# EAGLE schematic power_layout (EAGLE 9.6.2)

## Sheet 1 of 2
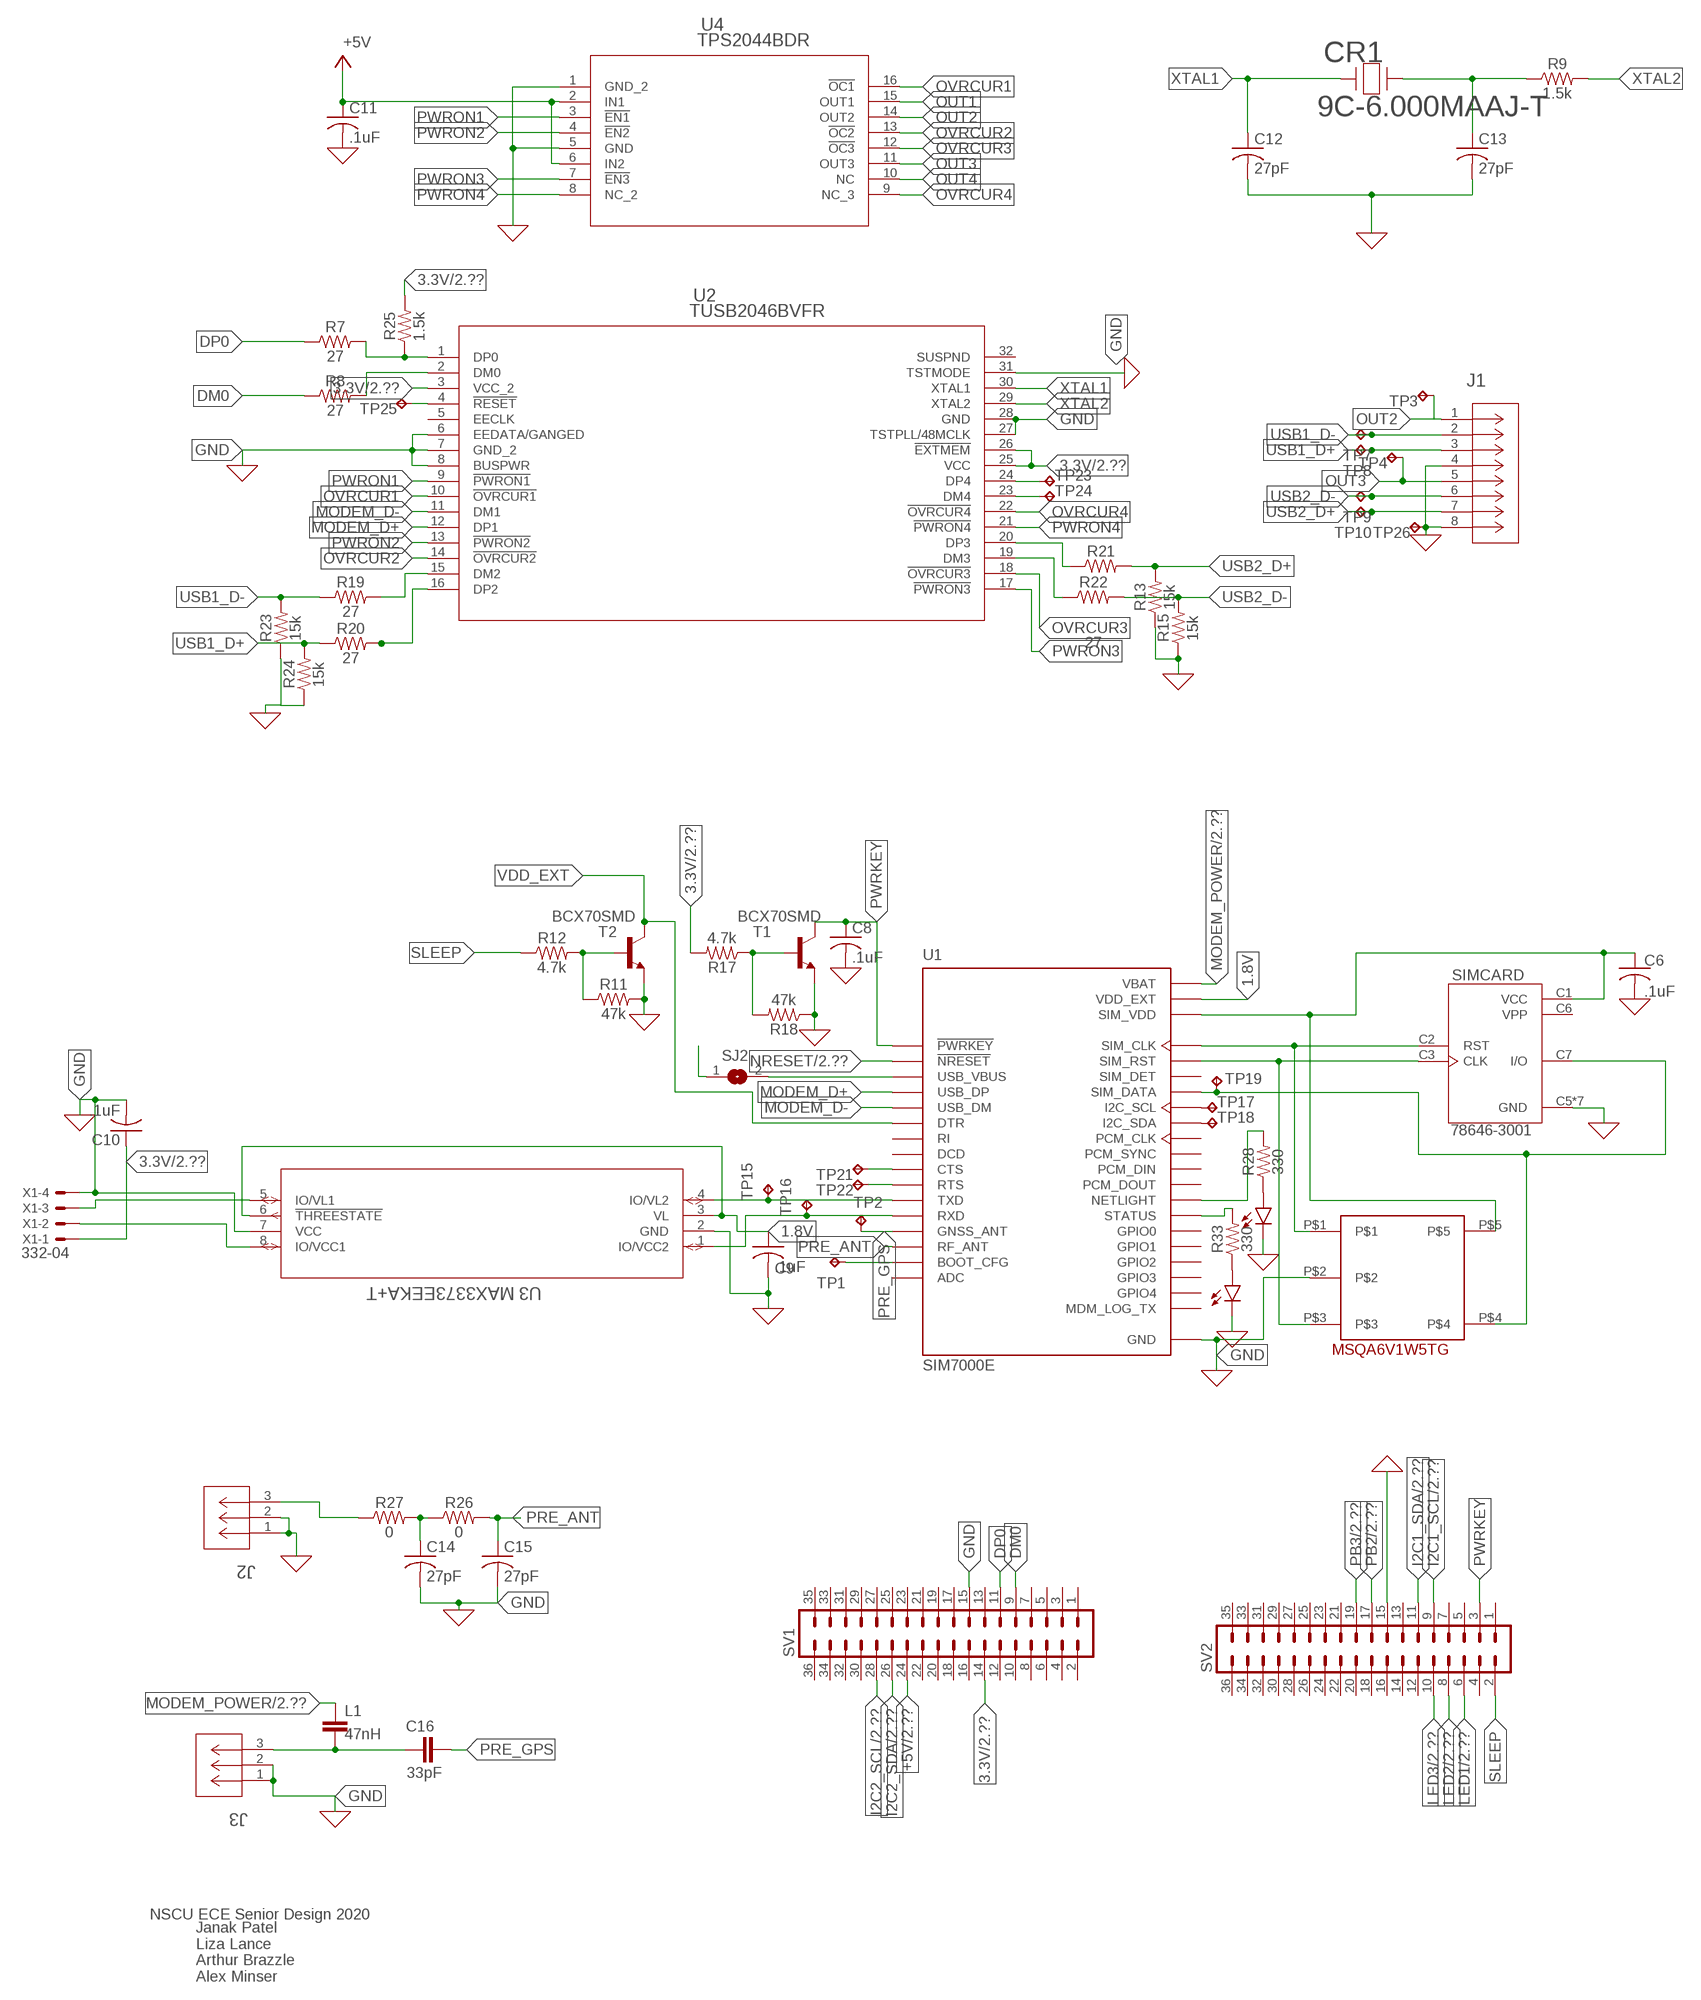
[diagram p0: schematic, sheet 1]

### Parts
C6  .1uF  C-USC0805  [C0805]
C8  .1uF  C-USC0805  [C0805]
C9  .1uF  C-USC0805  [C0805]
C10  .1uF  C-USC0805  [C0805]
C11  .1uF  C-USC0805  [C0805]
C12  27pF  C-USC0603  [C0603]
C13  27pF  C-USC0603  [C0603]
C14  27pF  C-USC0603  [C0603]
C15  27pF  C-USC0603  [C0603]
C16  33pF  C-EUC0603K  [C0603K]
CR1  9C-6.000MAAJ-T  [CRYSTAL_TXC_9C_TXC]
D4  Yellow  LED-YELLOW0603  [LED-0603]
D5  Yellow  LED-YELLOW0603  [LED-0603]
J1  AU-Y1008-2  [CONN_AU-Y1008-2_ASM]
J2  U.FL-R-SMT-1(01)  [CONN_-SMT-1(01)]
J3  U.FL-R-SMT-1(01)  [CONN_-SMT-1(01)]
L1  47nH  C-EUC1608  [C1608]
R7  27  RESISTOR0805  [0805]
R8  27  RESISTOR0805  [0805]
R9  1.5k  1KOHM-0603-1/10W-1%  [0603]
R11  47k  47KOHM-0603-1/10W-1%  [0603]
R12  4.7k  4.7KOHM-0603-1/10W-1%  [0603]
R13  15k  RESISTOR0805  [0805]
R15  15k  RESISTOR0805  [0805]
R17  4.7k  4.7KOHM-0603-1/10W-1%  [0603]
R18  47k  47KOHM-0603-1/10W-1%  [0603]
R19  27  RESISTOR0805  [0805]
R20  27  RESISTOR0805  [0805]
R21  27  RESISTOR0805  [0805]
R22  27  RESISTOR0805  [0805]
R23  15k  RESISTOR0805  [0805]
R24  15k  RESISTOR0805  [0805]
R25  1.5k  RESISTOR0805  [0805]
R26  0  1KOHM-0603-1/10W-1%  [0603]
R27  0  1KOHM-0603-1/10W-1%  [0603]
R28  330  1KOHM-0603-1/10W-1%  [0603]
R33  330  1KOHM-0603-1/10W-1%  [0603]
SIMCARD  78646-3001  [MOLEX_78646-3001]
SJ2  SJ  [SJ]
SV1  MA18-2  [MA18-2]
SV2  MA18-2  [MA18-2]
T1  BCX70SMD  [SOT23]
T2  BCX70SMD  [SOT23]
TP1  TPTP10R  [TP10R]
TP2  TPTP16R  [TP16R]
TP3  TPTP10R  [TP10R]
TP4  TPTP10R  [TP10R]
TP7  TPTP10R  [TP10R]
TP8  TPTP10R  [TP10R]
TP9  TPTP10R  [TP10R]
TP10  TPTP10R  [TP10R]
TP15  TPTP10R  [TP10R]
TP16  TPTP10R  [TP10R]
TP17  TPTP10R  [TP10R]
TP18  TPTP10R  [TP10R]
TP19  TPTP10R  [TP10R]
TP21  TPTP10R  [TP10R]
TP22  TPTP10R  [TP10R]
TP23  TPTP10R  [TP10R]
TP24  TPTP10R  [TP10R]
TP25  TPTP10R  [TP10R]
TP26  TPTP10R  [TP10R]
U1  SIM7000E  [SIMCON_SIM7000E]
U2  TUSB2046BVFR  [VF32_TEX]
U3  MAX3373EEKA+T  [21-0078H]
U4  TPS2044BDR  [D16_TEX]
U5  MSQA6V1W5T2G  [SOT-23-5_M5]
X1  332-04  [332-04]

### Nets
1.8V: C9.1 U1.15(VDD_EXT) U3.3(VL) U3.6(!THREESTATE)
3.3V [POWER]: C10.1 R17.2 R25.2 SV1.14 U2.3(VCC_2) U2.25(VCC) U2.26(!EXTMEM) X1.1 ; also sheet 2
+5V [POWER]: C11.1 SJ2.1 SV1.24 U4.2(IN1) U4.6(IN2) ; also sheet 2
DM0: R8.1 SV1.9
DP0: R7.1 SV1.11
GND [POWER]: C6.2 C8.2 C9.2 C10.2 C11.2 C12.2 C13.2 C14.2 C15.2 D4.C D5.C J1.4 J1.8 J2.1 J2.2 J3.1 J3.2 R11.2 R13.1 R15.1 R18.1 R23.1 R24.1 SIMCARD.C5(GND) SIMCARD.G1(GND) SIMCARD.G2(GND) SIMCARD.G3(GND) SIMCARD.G4(GND) SIMCARD.G5(GND) SIMCARD.G6(GND) SV1.15 SV2.15 T1.2(E) T2.2(E) TP26.TP U1.2(GND) U1.17(GND) U1.18(GND) U1.29(GND) U1.39(GND) U1.45(GND) U1.46(GND) U1.54(GND) U1.58(GND) U1.59(GND) U1.61(GND) U1.62(GND) U1.63(GND) U1.64(GND) U1.65(GND) U2.6(EEDATA/GANGED) U2.7(GND_2) U2.8(BUSPWR) U2.27(TSTPLL/48MCLK) U2.28(GND) U2.31(TSTMODE) U3.2(GND) U3.7(VCC) U4.1(GND_2) U4.5(GND) U5.P$2 X1.4 ; also sheet 2
I2C1_SCL: SV2.9 ; also sheet 2
I2C1_SDA: SV2.11 ; also sheet 2
I2C2_SCL: SV1.28 ; also sheet 2
I2C2_SDA: SV1.26 ; also sheet 2
LED1: SV2.6 ; also sheet 2
LED2: SV2.8 ; also sheet 2
LED3: SV2.10 ; also sheet 2
MODEM_D+: U1.27(USB_DP) U2.12(DP1)
MODEM_D-: U1.28(USB_DM) U2.11(DM1)
MODEM_POWER: L1.1 U1.55(VBAT) U1.56(VBAT) U1.57(VBAT) ; also sheet 2
N$1: C6.1 SIMCARD.C1(VCC) U1.30(SIM_VDD) U5.P$5
N$2: SIMCARD.C3(CLK) U1.33(SIM_RST) U5.P$3
N$4: SIMCARD.C2(RST) U1.32(SIM_CLK) U5.P$1
N$6: SIMCARD.C7(I/O) TP19.TP U1.31(SIM_DATA) U5.P$4
N$9: TP1.TP U1.6(BOOT_CFG)
N$10: R7.2 R25.1 U2.1(DP0)
N$11: C14.1 R26.1 R27.2
N$12: R8.2 U2.2(DM0)
N$13: U3.8(IO/VCC1) X1.2
N$14: C13.1 CR1.2 R9.1
N$15: C16.1 J3.3 L1.2
N$16: U3.5(IO/VL1) X1.3
N$17: R11.1 R12.2 T2.1(B)
N$18: R17.1 R18.2 T1.1(B)
N$19: R19.2 U2.15(DM2)
N$20: R20.2 U2.16(DP2)
N$21: TP21.TP U1.7(CTS)
N$22: R21.1 U2.20(DP3)
N$23: R22.1 U2.19(DM3)
N$24: TP17.TP U1.38(I2C_SCL)
N$25: TP23.TP U2.24(DP4)
N$26: TP24.TP U2.23(DM4)
N$27: TP16.TP U1.10(RXD) U3.1(IO/VCC2)
N$28: TP15.TP U1.9(TXD) U3.4(IO/VL2)
N$29: R28.2 U1.52(NETLIGHT)
N$30: D4.A R28.1
N$31: TP18.TP U1.37(I2C_SDA)
N$32: TP22.TP U1.8(RTS)
N$33: R33.2 U1.66(STATUS)
N$34: TP25.TP U2.4(!RESET)
N$35: J2.3 R27.1
N$36: SJ2.2 U1.24(USB_VBUS)
N$37: D5.A R33.1
NRESET: U1.16(!NRESET) ; also sheet 2
OUT1: U4.15(OUT1)
OUT2: J1.1 TP3.TP U4.14(OUT2)
OUT3: J1.5 TP4.TP U4.11(OUT3)
OUT4: U4.10(NC)
OVRCUR1: U2.10(!OVRCUR1) U4.16(!OC1)
OVRCUR2: U2.14(!OVRCUR2) U4.13(!OC2)
OVRCUR3: U2.18(!OVRCUR3) U4.12(!OC3)
OVRCUR4: U2.22(!OVRCUR4) U4.9(NC_3)
PB2: SV2.17 ; also sheet 2
PB3: SV2.19 ; also sheet 2
PRE_ANT: C15.1 R26.2 U1.60(RF_ANT)
PRE_GPS: C16.2 TP2.TP U1.53(GNSS_ANT)
PWRKEY: C8.1 SV2.3 T1.3(C) U1.1(!PWRKEY)
PWRON1: U2.9(!PWRON1) U4.3(!EN1)
PWRON2: U2.13(!PWRON2) U4.4(!EN2)
PWRON3: U2.17(!PWRON3) U4.7(!EN3)
PWRON4: U2.21(!PWRON4) U4.8(NC_2)
SLEEP: R12.1 SV2.2
USB1_D+: J1.3 R20.1 R24.2 TP8.TP
USB1_D-: J1.2 R19.1 R23.2 TP7.TP
USB2_D+: J1.7 R13.2 R21.2 TP10.TP
USB2_D-: J1.6 R15.2 R22.2 TP9.TP
VDD_EXT [POWER]: T2.3(C) U1.3(DTR)
XTAL1: C12.1 CR1.1 U2.30(XTAL1)
XTAL2: R9.2 U2.29(XTAL2)
Unconnected: SV1.1 SV1.2 SV1.3 SV1.4 SV1.5 SV1.6 SV1.7 SV1.8 SV1.10 SV1.12 SV1.13 SV1.16 SV1.17 SV1.18 SV1.19 SV1.20 SV1.21 SV1.22 SV1.23 SV1.25 SV1.27 SV1.29 SV1.30 SV1.31 SV1.32 SV1.33 SV1.34 SV1.35 SV1.36 SV2.1 SV2.4 SV2.5 SV2.7 SV2.12 SV2.13 SV2.14 SV2.16 SV2.18 SV2.20 SV2.21 SV2.22 SV2.23 SV2.24 SV2.25 SV2.26 SV2.27 SV2.28 SV2.29 SV2.30 SV2.31 SV2.32 SV2.33 SV2.34 SV2.35 SV2.36 U1.4(RI) U1.5(DCD) U1.11(PCM_CLK) U1.12(PCM_SYNC) U1.13(PCM_DIN) U1.14(PCM_DOUT) U1.23(MDM_LOG_TX) U1.25(ADC) U1.34(SIM_DET) U1.48(GPIO4) U1.49(GPIO1) U1.50(GPIO0) U1.67(GPIO2) U1.68(GPIO3) U2.5(EECLK) U2.32(SUSPND)

### Notes on the sheet
- NSCU ECE Senior Design 2020
- Janak Patel
  Liza Lance
  Arthur Brazzle
  Alex Minser

## Sheet 2 of 2
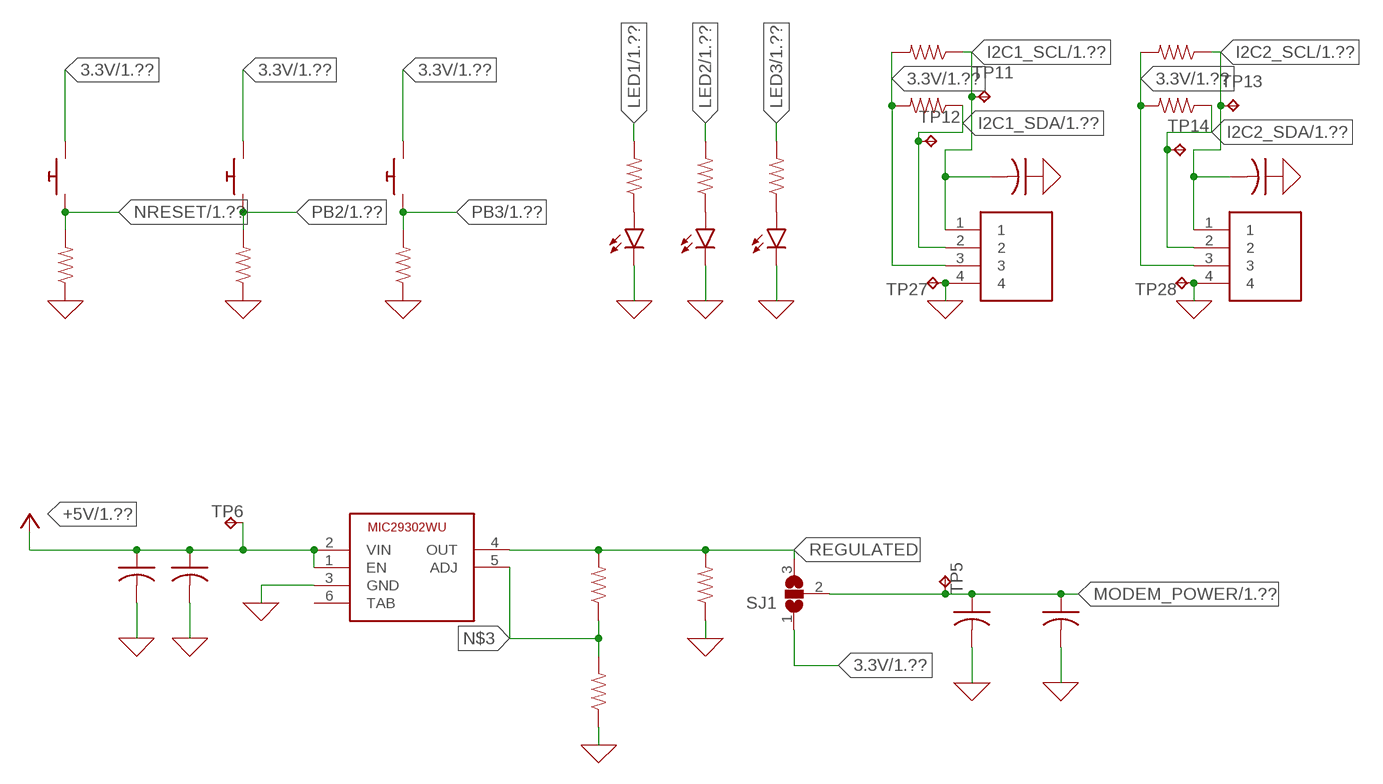
[diagram p1: schematic, sheet 2]

### Parts
C1  100uF  C-USC0805  [C0805]
C2  0.1uF  C-USC0805  [C0805]
C3  330uF  C-USC1210  [C1210]
C4  1uF  C-USC0805  [C0805]
C5  100nF  C-USC0805  [C0805]
C7  0.1uF  C-USC0805  [C0805]
D1  RED  LED-RED1206  [LED-1206]
D2  GREEN  LED-GREEN1206  [LED-1206]
D3  BLUE  LED-BLUE1206  [LED-1206]
GROVE1  640456-4  [TE_640456-4]
GROVE2  640456-4  [TE_640456-4]
POWER_SUPPLY  MIC29302WU  [TO263-5]
R1  60.4  RESISTOR0805  [0805]
R2  180  RESISTOR0805  [0805]
R3  180  RESISTOR0805  [0805]
R4  47k  RESISTOR0805  [0805]
R5  100k  RESISTOR0805  [0805]
R6  470k  RESISTOR0805  [0805]
R10  4700  RESISTOR0805  [0805]
R14  4700  RESISTOR0805  [0805]
R16  4700  RESISTOR0805  [0805]
R29  4700  RESISTOR0805  [0805]
R30  4700  RESISTOR0805  [0805]
R31  4700  RESISTOR0805  [0805]
R32  4700  RESISTOR0805  [0805]
SJ1  SJ2W  [SJ_2]
SW1  SWITCH_PUSHBUTTONSOFTTOUCHSMD_SJ  [PUSHBUTTON_SMD_SJ]
SW2  SWITCH_PUSHBUTTONSOFTTOUCHSMD_SJ  [PUSHBUTTON_SMD_SJ]
SW3  SWITCH_PUSHBUTTONSOFTTOUCHSMD_SJ  [PUSHBUTTON_SMD_SJ]
TP5  TPTP10R  [TP10R]
TP6  TPTP10R  [TP10R]
TP11  TPTP10R  [TP10R]
TP12  TPTP10R  [TP10R]
TP13  TPTP10R  [TP10R]
TP14  TPTP10R  [TP10R]
TP27  TPTP10R  [TP10R]
TP28  TPTP10R  [TP10R]

### Nets
3.3V [POWER]: GROVE1.3 GROVE2.3 R29.2 R30.2 R31.2 R32.2 SJ1.1 SW1.P$2 SW2.P$2 SW3.P$2 ; also sheet 1
+5V [POWER]: C1.1 C4.1 POWER_SUPPLY.1(EN) POWER_SUPPLY.2(VIN) TP6.TP ; also sheet 1
GND [POWER]: C1.2 C2.1 C3.2 C4.2 C5.2 C7.1 D1.C D2.C D3.C GROVE1.4 GROVE2.4 POWER_SUPPLY.3(GND) R4.1 R6.1 R10.1 R14.1 R16.1 TP27.TP TP28.TP ; also sheet 1
I2C1_SCL: C2.2 GROVE1.1 R29.1 TP11.TP ; also sheet 1
I2C1_SDA: GROVE1.2 R30.1 TP12.TP ; also sheet 1
I2C2_SCL: C7.2 GROVE2.1 R31.1 TP13.TP ; also sheet 1
I2C2_SDA: GROVE2.2 R32.1 TP14.TP ; also sheet 1
LED1: R3.2 ; also sheet 1
LED2: R2.2 ; also sheet 1
LED3: R1.2 ; also sheet 1
MODEM_POWER: C3.1 C5.1 SJ1.2 TP5.TP ; also sheet 1
N$3: POWER_SUPPLY.5(ADJ) R4.2 R5.1
N$5: D3.A R1.1
N$7: D2.A R2.1
N$8: D1.A R3.1
NRESET: R10.2 SW1.P$1 ; also sheet 1
PB2: R14.2 SW2.P$1 ; also sheet 1
PB3: R16.2 SW3.P$1 ; also sheet 1
REGULATED: POWER_SUPPLY.4(OUT) R5.2 R6.2 SJ1.3
Unconnected: POWER_SUPPLY.6(TAB)

## Power pins joined to a net without a drawn wire
VPP: SIMCARD.C6(VPP)

## Library data of the parts
C1-C15 = rcl:C-US: CAPACITOR, American symbol; SPICEPREFIX: C
C16 L1 = rcl:C-EU: CAPACITOR, European symbol; SPICEPREFIX: C
CR1 = Personal:9C-6.000MAAJ-T; BUILT_BY: EMA_UL_Team; MANUFACTURER_PART_NUMBER: 9C-6.000MAAJ-T; SOURCELIBRARY: TXC_2011-01-01_CRYSTAL_9C; VENDOR: TXC
D1 = SparkFun-LED:LED-RED: Red SMD LED Used in manufacturing of most products at SparkFun Packages: 0603 - SMD 0603 package [Product Link] <http://docs.avagotech.com/docs/AV02-0551EN> 0603 SMART - SMD 0603 SMART package ( more efficient and expensive)[Product Link] <http://www.osram-os.com/Graphics/XPic2/00077099_0.pdf> 1206 - SMD1206 package [Product Link] <https://www.sparkfun.com/datasheets/DevTools/LilyPad/Q150OVS4.pdff> SparkFun Products: Pro Mini 328 -5V <https://www.sparkfun.com/products/821> RedBoard <https://www.sparkfun.com/products/12757> IOIO-OTG <https://www.sparkfun.com/products/13613>; PROD_ID: DIO-09912
D2 = SparkFun-LED:LED-GREEN: Green SMD LED Used in manufacturing of various products at SparkFun Packages: 0603 - SMD 0603 package [Product Link] <http://www.futureelectronics.com/en/technologies/semiconductors/optoelectronics/leds/Pages/9894312-LTST-C190GKT.aspx?CrossPart=HSMG-C190&IM=0> LilyPad 1206 - SMD1206 LilyPad package [Product Link] <http://www.futureelectronics.com/en/Technologies/Product.aspx?ProductID=IN150NGHARVATEKCORPORATION2049943&IM=0> 1206 - SMD1206 package [Product Link] <http://www.futureelectronics.com/en/technologies/semiconductors/optoelectronics/leds/Pages/8315665-LTST-C150KGKT.aspx?IM=0> 1206 Bottom Mount -SMD 1206 Bottom Mount [Product Link] <http://www.digikey.com/product-detail/en/lite-on-inc/LTST-C230KGKT/160-1456-1-ND/386854> SparkFun Products: Pro Mini 328 -5V <https://www.sparkfun.com/products/821> RedBoard <https://www.sparkfun.com/products/12757> MP3 Trigger <https://www.sparkfun.com/products/13720> Makey Makey <https://www.sparkfun.com/products/11076>; PROD_ID: DIO-00862
D3 = SparkFun-LED:LED-BLUE: Blue SMD LED Used in manufacturing of various products at SparkFun Packages: 0603 - SMD 0603 package [Product Link] <http://www.digikey.com/product-detail/en/SMLE12BC7TT86/511-1589-2-ND/1641808> 1206 - SMD1206 package [Product Link] <http://www.digikey.com/product-detail/en/lite-on-inc/LTST-C150TBKT/160-1643-1-ND/573584> SparkFun Products: ESP8266 Thing-Dev Board <https://www.sparkfun.com/products/13711> RedBoard <https://www.sparkfun.com/products/12757>; PROD_ID: DIO-09911
D4 D5 = SparkFun-LED:LED-YELLOW: Yellow SMD LED Used in manufacturing several products at SparkFun. Packages: 0603 - SMD 0603 package[Product Link] <http://www.kingbrightusa.com/product.asp?catalog_name=LED&product_id=APT1608SYCK> 0603 -SMART - SMART SMD 0603 package (more efficient/more expensive) [Product Link] <http://www.osram-os.com/osram_os/en/products/product-catalog/led-light-emitting-diodes/smartled-0603/ly-l29k/index.jsp> LilyPad - SMD1206 package[Product Datasheet] <https://www.sparkfun.com/datasheets/DevTools/LilyPad/Q150YUS4.pdf> SparkFun Products: Blynk Board <https://www.sparkfun.com/products/13794> IOIO-OTG <https://www.sparkfun.com/products/13613> XBee Explorer Serial <https://www.sparkfun.com/products/13225>; PROD_ID: DIO-09003
GROVE1 GROVE2 = 640456-4:640456-4: 220P MTA100 HDR ASSY SQ SPCL; CENTERLINE_PITCH: 2.54 mm[.1 in]; COMMENT: 640456-4; DESCRIPTION: Header, Friction Lock; MTA-100; 4; 250 VAC; Polyester; Tin; Copper Alloy; Tin; DIGI-KEY_PART_NUMBER: A1922-ND; DIGI-KEY_PURCHASE_URL: https://www.digikey.com/product-detail/en/te-connectivity-amp-connectors/640456-4/A1922-ND/109006?utm_source=snapeda&utm_medium=aggregator&utm_campaign=symbol; EU_ROHS_COMPLIANCE: Compliant; MF: TE Connectivity; MP: 640456-4; NUMBER_OF_POSITIONS: 4; PACKAGE: None; PRODUCT_TYPE: Connector; TE_PURCHASE_URL: https://www.te.com/usa-en/product-640456-4.html?te_bu=Cor&te_type=disp&te_campaign=seda_glo_cor-seda-global-disp-prtnr-fy19-seda-model-bom-cta_sma-317_1&elqCampaignId=32493
J1 = Personal:AU-Y1008-2; BUILT_BY: EMA_Cory; COPYRIGHT: Copyright (C) 2018 Accelerated Designs. All rights reserved; DATASHEET: http://www.assmann-wsw.com/fileadmin/datasheets/ASS_5780_CO.pdf; MANUFACTURER_PART_NUMBER: AU-Y1008-2; SOURCELIBRARY: Assmann_2020-03-30; VENDOR: Assmann
J2 J3 = Personal:U.FL-R-SMT-1(01); BUILT_BY: EMA_Matt; COPYRIGHT: Copyright (C) 2018 Accelerated Designs. All rights reserved; MANUFACTURER_PART_NUMBER: U.FL-R-SMT-1(01); SOURCELIBRARY: Hirose_12_20_2019; VENDOR: Hirose
POWER_SUPPLY = MIC29302WU:MIC29302WU; AVAILABILITY: Unavailable; DESCRIPTION: Linear Voltage Regulator IC 1 Output 3A TO-263-5; MF: Microchip Technology; MP: MIC29302WU; PACKAGE: TO-263-6 Microchip Technology; PRICE: None
R1-R8 R10 R13-R16 R19-R25 R29-R32 = SparkFun-Resistors:RESISTOR: Generic Resistor Package
R9 R26-R28 R33 = SparkFun-Resistors:1KOHM: 1kΩ resistor A resistor is a passive two-terminal electrical component that implements electrical resistance as a circuit element. Resistors act to reduce current flow, and, at the same time, act to lower voltage levels within circuits. - Wikipedia; PROD_ID: RES-07856; VALUE: 1k
R11 R18 = SparkFun-Resistors:47KOHM: 47kΩ resistor A resistor is a passive two-terminal electrical component that implements electrical resistance as a circuit element. Resistors act to reduce current flow, and, at the same time, act to lower voltage levels within circuits. - Wikipedia; PROD_ID: RES-07871
R12 R17 = SparkFun-Resistors:4.7KOHM: 4.7kΩ resistor A resistor is a passive two-terminal electrical component that implements electrical resistance as a circuit element. Resistors act to reduce current flow, and, at the same time, act to lower voltage levels within circuits. - Wikipedia; PROD_ID: RES-07857
SIMCARD = 78646-3001:78646-3001: Conn Micro SIM Card SKT 6 POS 2.54mm Solder RA SMD 0.5A/Contact Embossed T/R; AVAILABILITY: Unavailable; DESCRIPTION: 6 Position Card Connector Micro SIM Surface Mount, Right Angle Gold; MF: Molex; MP: 78646-3001; PACKAGE: None; PRICE: None
SJ1 = jumper:SJ2W: SMD solder JUMPER
SJ2 = jumper:SJ: SMD solder JUMPER
SV1 SV2 = con-lstb:MA18-2: PIN HEADER; OC_FARNELL: unknown; OC_NEWARK: unknown
SW1-SW3 = adafruit:SWITCH_PUSHBUTTON: Buttons SOFTTOUCHSMD_SJ - Soft touch temporary push button (Super Junk Akihabara) Compatible with SKPMANE010 [Mouser: 688-SKPMAN] C&K_KSS = Digikey: KSS221GLFS
T1 T2 = transistor:BCX70SMD: NPN TRANSISTOR
TP1-TP19 TP21-TP28 = testpad:TP: Test pad
U1 = SIM7000E:SIM7000E: Multi-Band LTE-FDD and Dual-Band GSM/GPRS/EDGE module solution in a SMT type which supports LTE eMTC(CAT-M1) and NB-IoT up to 375kbps for downlink data transfer.; AVAILABILITY: Unavailable; DESCRIPTION: SIM7000E GSM/GPRS RF Arduino Platform Evaluation Expansion Board; MF: DFRobot; MP: SIM7000E; PACKAGE: Package Analog Devices; PRICE: None
U2 = Personal:TUSB2046BVFR; BUILT_BY: EMA_UL_Team; COPYRIGHT: Copyright (C) 2018 Accelerated Designs. All rights reserved; MANUFACTURER: Texas Instruments; MANUFACTURER_PART_NUMBER: TUSB2046BVFR; SOURCELIBRARY: Texas_Instruments_2018-12-15; VENDOR: Texas Instruments
U3 = Personal:MAX3373EEKA+T; BUILT_BY: EMA_UL_Team; MANUFACTURER_PART_NUMBER: max3373eeka+t; SOURCELIBRARY: Maxim_2009-12-17_3a; VENDOR: Maxim Integrated Products
U4 = Personal:TPS2044BDR; BUILT_BY: EMA_UL_Team; MANUFACTURER: Texas Instruments; MANUFACTURER_PART_NUMBER: TPS2044BDR; SOURCELIBRARY: TI_2014-06-19; VENDOR: Texas Instruments
U5 = Personal:MSQA6V1W5T2G: MSQA6V1W5T2G TVS DIODE 3V SC88A Clamp Ipp Tvs Diode Surface Mount SC-88A (SC-70-5/SOT-353) https://www.digikey.com/product-detail/en/on-semiconductor/MSQA6V1W5T2G/MSQA6V1W5T2GOSDKR-ND/1967490
X1 = con-garry:332-04: 4 Pin - 2mm Dual Row Source: www.mpe-connector.de / garry_shortform_2012.pdf

## Net classes
0 default: width 0.152 mm, drill 0.152 mm, clearance 0.152 mm
1 POWER: width 0.152 mm, drill 0.152 mm, clearance 0.152 mm